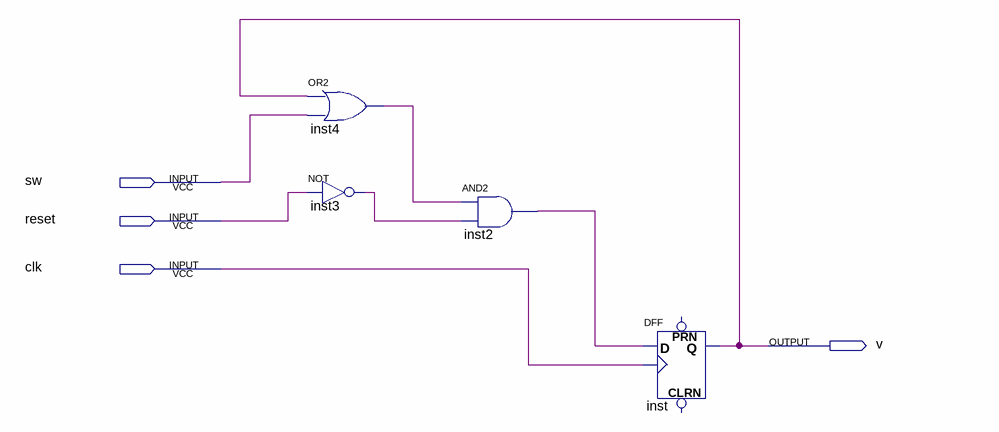
[diagram p0: schematic sheet]
// Quartus schematic sword.bdf as structural Verilog: 4 symbols, 4 pins
module sword (
  input  sw,
  input  reset,
  input  clk,
  output v
);

  wire inst2_out, inst3_out, inst4_out;

  or inst4 (inst4_out, v, sw);
  not inst3 (inst3_out, reset);
  and inst2 (inst2_out, inst4_out, inst3_out);
  DFF inst (.CLK(clk), .D(inst2_out), .Q(v));  // open: CLRN, PRN
endmodule
